# EAGLE design zeta2rework_lw_v8 (EAGLE 9.0.1)
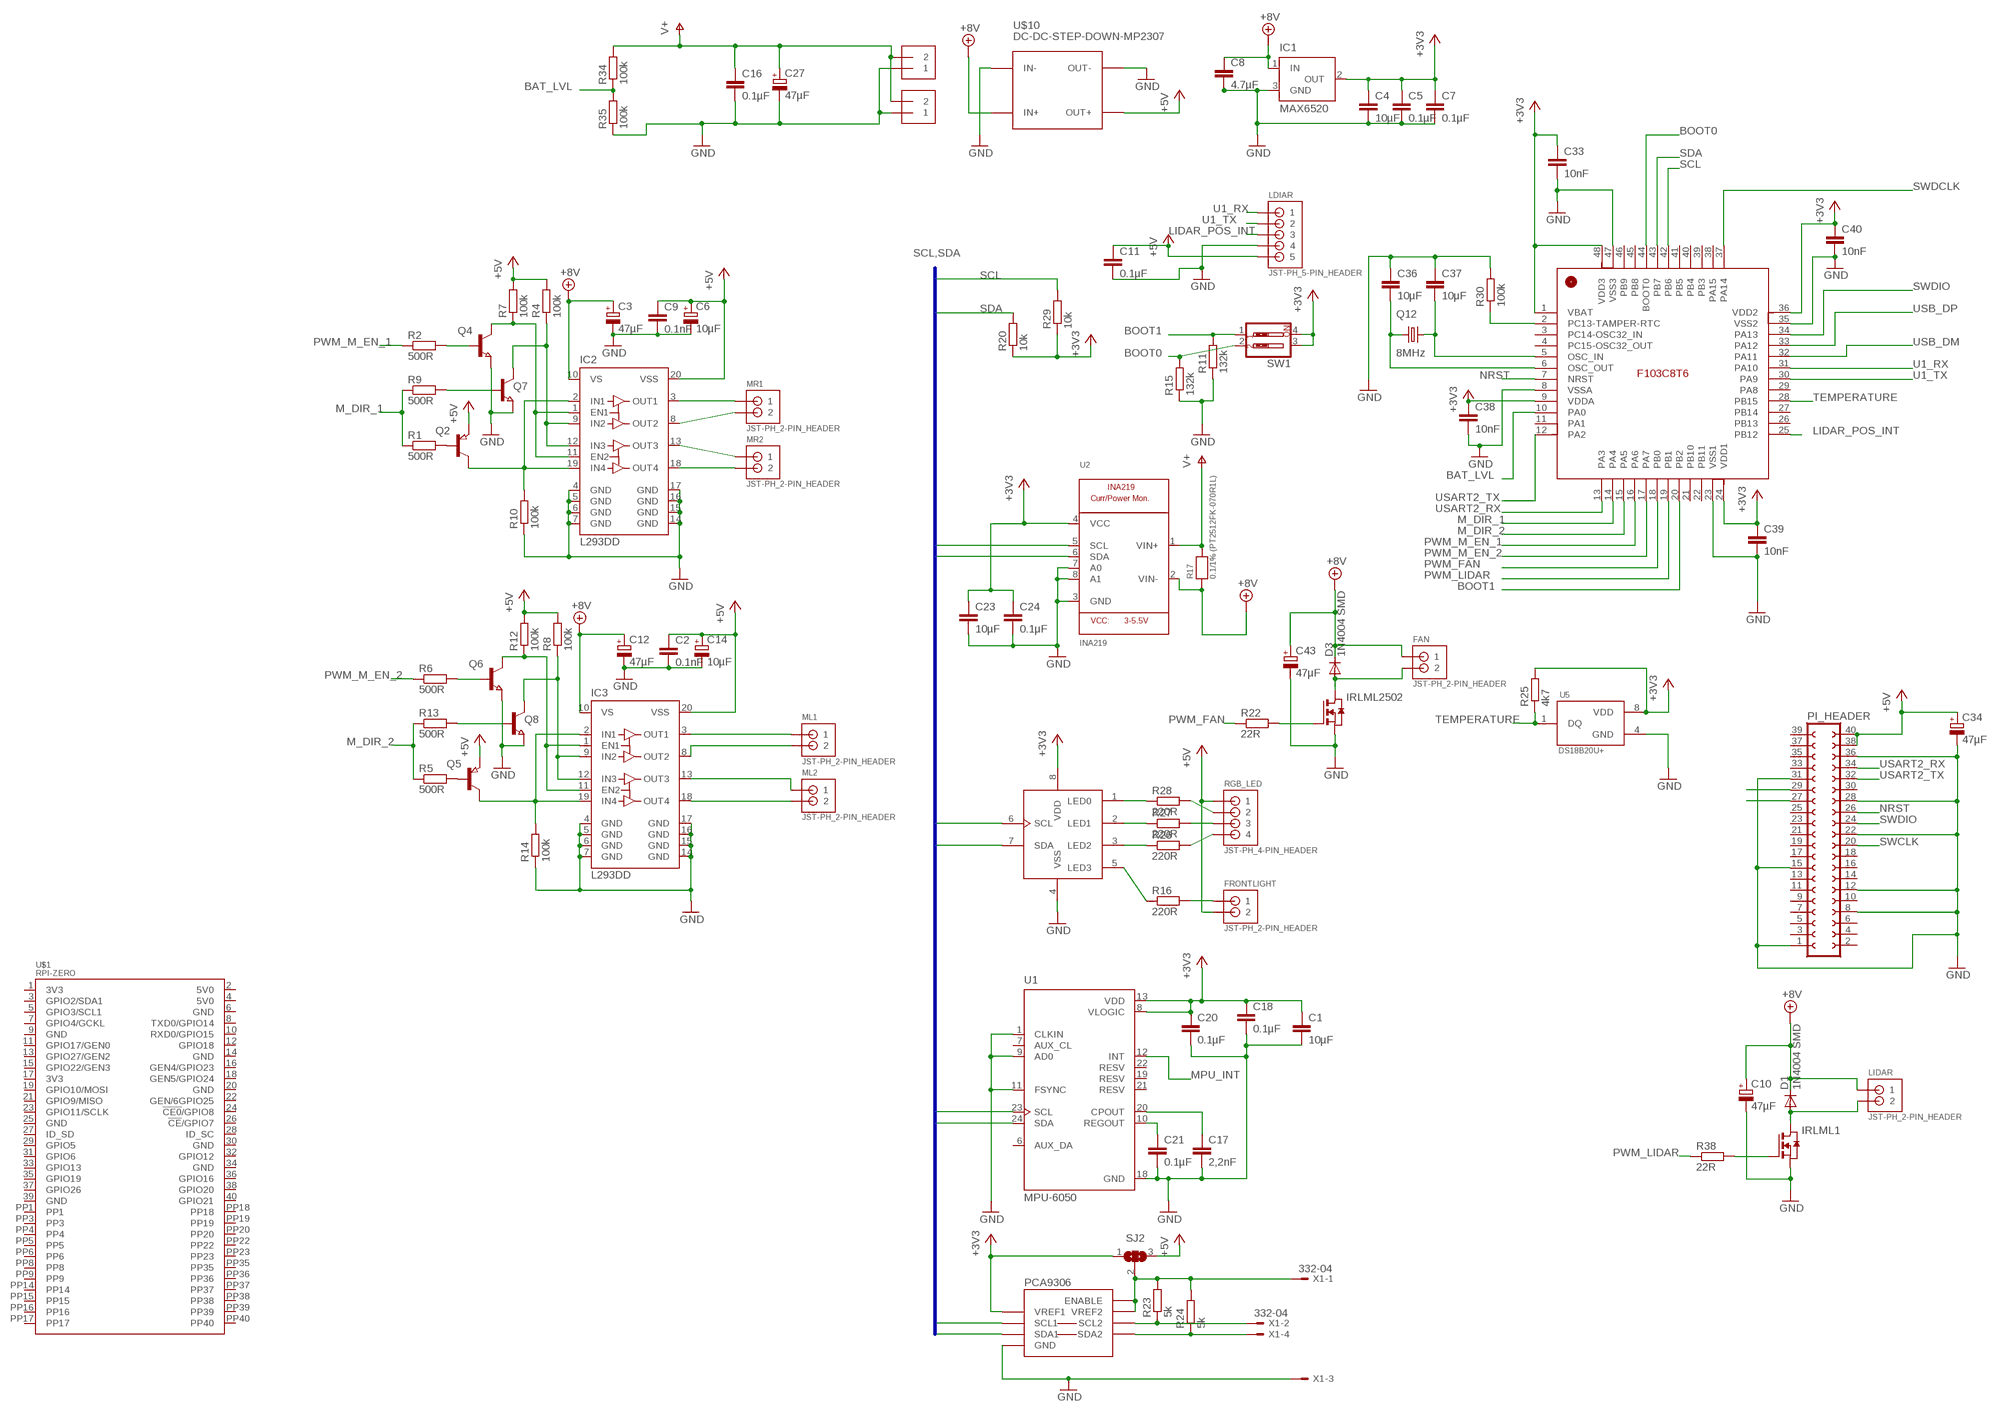
[diagram p0: schematic, sheet 1]

## Parts
C1  10µF  C-EUC1206  [C1206]
C2  0.1nF  C-EUC1206  [C1206]
C3  47µF  CPOL-EUUD-4X5,8  [UD-4X5,8_NICHICON]
C4  10µF  C-EUC1206  [C1206]
C5  0.1µF  C-EUC1206  [C1206]
C6  10µF  CPOL-EUUD-4X5,8  [UD-4X5,8_NICHICON]
C7  0.1µF  C-EUC1206  [C1206]
C8  4.7µF  C-EUC1206  [C1206]
C9  0.1nF  C-EUC1206  [C1206]
C10  47µF  CPOL-EUUD-4X5,8  [UD-4X5,8_NICHICON]
C11  0.1µF  C-EUC1206  [C1206]
C12  47µF  CPOL-EUUD-4X5,8  [UD-4X5,8_NICHICON]
C14  10µF  CPOL-EUUD-4X5,8  [UD-4X5,8_NICHICON]
C16  0.1µF  C-EUC1206  [C1206]
C17  2,2nF  C-EUC1206  [C1206]
C18  0.1µF  C-EUC1206  [C1206]
C20  0.1µF  C-EUC1206  [C1206]
C21  0.1µF  C-EUC1206  [C1206]
C23  10µF  C-EUC1206  [C1206]
C24  0.1µF  C-EUC1206  [C1206]
C27  47µF  CPOL-EUUD-4X5,8  [UD-4X5,8_NICHICON]
C33  10nF  C-EUC1206  [C1206]
C34  47µF  CPOL-EUUD-4X5,8  [UD-4X5,8_NICHICON]
C36  10µF  C-EUC1206  [C1206]
C37  10µF  C-EUC1206  [C1206]
C38  10nF  C-EUC1206  [C1206]
C39  10nF  C-EUC1206  [C1206]
C40  10nF  C-EUC1206  [C1206]
C43  47µF  CPOL-EUUD-4X5,8  [UD-4X5,8_NICHICON]
D1  1N4004 SMD  DIODE-DO214AC  [DO214AC]
D3  1N4004 SMD  DIODE-DO214AC  [DO214AC]
FAN  JST-PH_2-PIN_HEADER  [JST_B2B-PH_HEADER]
FRONTLIGHT  JST-PH_2-PIN_HEADER  [JST_B2B-PH_HEADER]
IC1  MAX6520  [SOT23]
IC2  L293DD  [SO20]
IC3  L293DD  [SO20]
IRLML1  NMOSSOT23  [SOT-23]
IRLML2502  NMOSSOT23  [SOT-23]
LDIAR  JST-PH_5-PIN_HEADER  [JST_B5B-PH_HEADER]
LIDAR  JST-PH_2-PIN_HEADER  [JST_B2B-PH_HEADER]
ML1  JST-PH_2-PIN_HEADER  [JST_B2B-PH_HEADER]
ML2  JST-PH_2-PIN_HEADER  [JST_B2B-PH_HEADER]
MR1  JST-PH_2-PIN_HEADER  [JST_B2B-PH_HEADER]
MR2  JST-PH_2-PIN_HEADER  [JST_B2B-PH_HEADER]
PCA9306  IC2_LEVEL_TRANSLATER  [SOIC-8]
PCA9533  PCA9533  [SOIC8]
PI_HEADER  FE20-2  [FE20-2]
Q2  PNP-TRANSISTOR_SOT23  [SOT23]
Q4  NPN-TRANSISTOR_SOT23  [SOT23]
Q5  PNP-TRANSISTOR_SOT23  [SOT23]
Q6  NPN-TRANSISTOR_SOT23  [SOT23]
Q7  NPN-TRANSISTOR_SOT23  [SOT23]
Q8  NPN-TRANSISTOR_SOT23  [SOT23]
Q12  8MHz  KX-13  [7.0X5.0]
R1  500R  R-EU_R0603  [R0603]
R2  500R  R-EU_R0603  [R0603]
R4  100k  R-EU_R0603  [R0603]
R5  500R  R-EU_R0603  [R0603]
R6  500R  R-EU_R0603  [R0603]
R7  100k  R-EU_R0603  [R0603]
R8  100k  R-EU_R0603  [R0603]
R9  500R  R-EU_R0603  [R0603]
R10  100k  R-EU_R0603  [R0603]
R11  132k  R-EU_R0603  [R0603]
R12  100k  R-EU_R0603  [R0603]
R13  500R  R-EU_R0603  [R0603]
R14  100k  R-EU_R0603  [R0603]
R15  132k  R-EU_R0603  [R0603]
R16  220R  R-EU_R0603  [R0603]
R17  0.1/1% (PT2512FK-070R1L)  RESISTOR2512  [2512]
R20  10k  R-EU_R0603  [R0603]
R22  22R  R-EU_R0603  [R0603]
R23  5k  R-EU_R0603  [R0603]
R24  5k  R-EU_R0603  [R0603]
R25  4k7  R-EU_R0603  [R0603]
R26  220R  R-EU_R0603  [R0603]
R27  220R  R-EU_R0603  [R0603]
R28  220R  R-EU_R0603  [R0603]
R29  10k  R-EU_R0603  [R0603]
R30  100k  R-EU_R0603  [R0603]
R34  100k  R-EU_R0603  [R0603]
R35  100k  R-EU_R0603  [R0603]
R38  22R  R-EU_R0603  [R0603]
RGB_LED  JST-PH_4-PIN_HEADER  [JST_B4B-PH_HEADER]
SJ2  SJ2W  [SJ_2]
STM32F103CB  STM32F103CB  STM32F103C8T6  [LQFP48_7X7MM_0.5MMPP]
SUPPLY_IN  TERMBLOCK_1X2-3.5MM  [1X2-3.5MM]
SUPPLY_IN1  TERMBLOCK_1X2-3.5MM  [1X2-3.5MM]
SW1  SW_DIP-2  [EDG-02]
U1  MPU-6050  [QFN50P400X400X95-24N]
U2  INA219  [SOT23-8]
U5  DS18B20U+  [SOP65P490X95-8N]
U$1  RPI-ZERO  [RASP_PI_ZERO_BOARD_FULL]
U$10  DC-DC-STEP-DOWN-MP2307  [DC-DC-STEP-DOWN-MP2307]
X1  332-04  [332-04]

## Nets
+3V3: C1.1 C4.1 C5.1 C7.1 C18.1 C20.1 C23.1 C24.1 C33.1 C38.1 C39.1 C40.1 IC1.2(OUT) PCA9306.1(VREF1) PCA9533.8(VDD) R20.1 R25.2 R29.1 SJ2.1 STM32F103CB.1(VBAT) STM32F103CB.9(VDDA) STM32F103CB.24(VDD1) STM32F103CB.36(VDD2) STM32F103CB.48(VDD3) SW1.3 SW1.4 U1.8(VLOGIC) U1.13(VDD) U2.4(VCC) U5.8(VDD)
+5V: C2.1 C6.+ C9.1 C11.1 C14.+ C34.+ FRONTLIGHT.P2 IC2.20(VSS) IC3.20(VSS) LDIAR.P5 PI_HEADER.38 PI_HEADER.40 Q2.2(E) Q5.2(E) R4.2 R7.2 R8.2 R12.2 RGB_LED.P1 SJ2.3 U$10.OUT+
+8V: C3.+ C8.1 C10.+ C12.+ C43.+ D1.C D3.C FAN.P1 IC1.1(IN) IC2.10(VS) IC3.10(VS) LIDAR.P1 R17.1 U2.2(VIN-) U$10.IN+
BAT_LVL: R34.1 R35.2 STM32F103CB.10(PA0)
BOOT0: R15.2 STM32F103CB.44(BOOT0) SW1.2
BOOT1: R11.2 STM32F103CB.20(PB2) SW1.1
BOOT2: PI_HEADER.29
BOOT3: PI_HEADER.27
GND: C1.2 C2.2 C3.- C4.2 C5.2 C6.- C7.2 C8.2 C9.2 C10.- C11.2 C12.- C14.- C16.2 C17.2 C18.2 C20.2 C21.2 C23.2 C24.2 C27.- C33.2 C34.- C36.1 C37.1 C38.2 C39.2 C40.2 C43.- IC1.3(GND) IC2.4(GND) IC2.5(GND) IC2.6(GND) IC2.7(GND) IC2.14(GND) IC2.15(GND) IC2.16(GND) IC2.17(GND) IC3.4(GND) IC3.5(GND) IC3.6(GND) IC3.7(GND) IC3.14(GND) IC3.15(GND) IC3.16(GND) IC3.17(GND) IRLML1.2(S) IRLML2502.2(S) LDIAR.P4 PCA9306.4(GND) PCA9533.4(VSS) PI_HEADER.1 PI_HEADER.8 PI_HEADER.12 PI_HEADER.15 PI_HEADER.22 PI_HEADER.28 PI_HEADER.31 PI_HEADER.36 Q4.2(E) Q6.2(E) Q7.2(E) Q8.2(E) R10.1 R11.1 R14.1 R15.1 R30.2 R35.1 STM32F103CB.8(VSSA) STM32F103CB.23(VSS1) STM32F103CB.35(VSS2) STM32F103CB.47(VSS3) SUPPLY_IN1.1 SUPPLY_IN.1 U1.1(CLKIN) U1.9(AD0) U1.11(FSYNC) U1.18(GND) U2.3(GND) U2.7(A0) U2.8(A1) U5.4(GND) U$10.IN- U$10.OUT- X1.3
LIDAR_POS_INT: LDIAR.P3 STM32F103CB.25(PB12)
M_DIR_1: R1.1 R9.1 STM32F103CB.14(PA4)
M_DIR_2: R5.1 R13.1 STM32F103CB.15(PA5)
MPU_INT: U1.12(INT)
N$1: IC2.9(IN2) IC2.12(IN3) Q7.3(C) R4.1
N$2: IC3.18(OUT4) ML2.P2
N$3: IC3.13(OUT3) ML2.P1
N$4: IC2.18(OUT4) MR2.P2
N$5: IC2.2(IN1) IC2.19(IN4) Q2.3(C) R10.2
N$6: IC3.9(IN2) IC3.12(IN3) Q8.3(C) R8.1
N$7: IC3.2(IN1) IC3.19(IN4) Q5.3(C) R14.2
N$8: IC2.1(EN1) IC2.11(EN2) Q4.3(C) R7.1
N$9: IC3.1(EN1) IC3.11(EN2) Q6.3(C) R12.1
N$10: Q2.1(B) R1.2
N$11: Q4.1(B) R2.2
N$12: Q7.1(B) R9.2
N$13: Q5.1(B) R5.2
N$14: Q6.1(B) R6.2
N$15: Q8.1(B) R13.2
N$16: IC2.13(OUT3) MR2.P1
N$17: IC2.8(OUT2) MR1.P2
N$18: IC2.3(OUT1) MR1.P1
N$20: PCA9533.5(LED3) R16.1
N$21: FRONTLIGHT.P1 R16.2
N$22: PCA9533.3(LED2) R26.1
N$23: PCA9533.2(LED1) R27.1
N$24: PCA9533.1(LED0) R28.1
N$25: IC3.8(OUT2) ML1.P2
N$26: IC3.3(OUT1) ML1.P1
N$31: R26.2 RGB_LED.P4
N$33: R27.2 RGB_LED.P3
N$34: C17.1 U1.20(CPOUT)
N$35: R28.2 RGB_LED.P2
N$36: C21.1 U1.10(REGOUT)
N$37: IRLML2502.3(G) R22.2
N$38: IRLML1.3(G) R38.2
N$39: D1.A IRLML1.1(D) LIDAR.P2
N$41: PCA9306.7(VREF2) PCA9306.8(ENABLE) R23.2 R24.2 SJ2.2 X1.1
N$42: PCA9306.6(SCL2) R23.1 X1.2
N$43: PCA9306.5(SDA2) R24.1 X1.4
N$46: C36.2 Q12.1 STM32F103CB.6(OSC_OUT)
N$47: C37.2 Q12.3 STM32F103CB.5(OSC_IN)
N$49: R30.1 STM32F103CB.2(PC13-TAMPER-RTC)
N$55: D3.A FAN.P2 IRLML2502.1(D)
NRST: PI_HEADER.26 STM32F103CB.7(NRST)
PWM_FAN: R22.1 STM32F103CB.18(PB0)
PWM_LIDAR: R38.1 STM32F103CB.19(PB1)
PWM_M_EN_1: R2.1 STM32F103CB.16(PA6)
PWM_M_EN_2: R6.1 STM32F103CB.17(PA7)
SCL: PCA9533.6(SCL) R29.2 STM32F103CB.42(PB6) U1.23(SCL) U2.5(SCL)
SCL2: PCA9306.2(SCL1)
SDA: PCA9533.7(SDA) R20.2 STM32F103CB.43(PB7) U1.24(SDA) U2.6(SDA)
SDA2: PCA9306.3(SDA1)
SWCLK: PI_HEADER.20
SWDCLK: STM32F103CB.37(PA14)
SWDIO: PI_HEADER.24 STM32F103CB.34(PA13)
TEMPERATURE: R25.1 STM32F103CB.28(PB15) U5.1(DQ)
U1_RX: LDIAR.P1 STM32F103CB.31(PA10)
U1_TX: LDIAR.P2 STM32F103CB.30(PA9)
USART2_RX: PI_HEADER.34 STM32F103CB.13(PA3)
USART2_TX: PI_HEADER.32 STM32F103CB.12(PA2)
USB_DM: STM32F103CB.32(PA11)
USB_DP: STM32F103CB.33(PA12)
V+: C16.1 C27.+ R17.2 R34.2 SUPPLY_IN1.2 SUPPLY_IN.2 U2.1(VIN+)
Unconnected: PI_HEADER.2 PI_HEADER.3 PI_HEADER.4 PI_HEADER.5 PI_HEADER.6 PI_HEADER.7 PI_HEADER.9 PI_HEADER.10 PI_HEADER.11 PI_HEADER.13 PI_HEADER.14 PI_HEADER.16 PI_HEADER.17 PI_HEADER.18 PI_HEADER.19 PI_HEADER.21 PI_HEADER.23 PI_HEADER.25 PI_HEADER.30 PI_HEADER.33 PI_HEADER.35 PI_HEADER.37 PI_HEADER.39 STM32F103CB.3(PC14-OSC32_IN) STM32F103CB.4(PC15-OSC32_OUT) STM32F103CB.11(PA1) STM32F103CB.21(PB10) STM32F103CB.22(PB11) STM32F103CB.26(PB13) STM32F103CB.27(PB14) STM32F103CB.29(PA8) STM32F103CB.38(PA15) STM32F103CB.39(PB3) STM32F103CB.40(PB4) STM32F103CB.41(PB5) STM32F103CB.45(PB8) STM32F103CB.46(PB9) U1.6(AUX_DA) U1.7(AUX_CL) U1.19(RESV) U1.21(RESV) U1.22(RESV) U$1.1(3V3) U$1.2(5V0) U$1.3(GPIO2/SDA1) U$1.4(5V0) U$1.5(GPIO3/SCL1) U$1.6(GND) U$1.7(GPIO4/GCKL) U$1.8(TXD0/GPIO14) U$1.9(GND) U$1.10(RXD0/GPIO15) U$1.11(GPIO17/GEN0) U$1.12(GPIO18) U$1.13(GPIO27/GEN2) U$1.14(GND) U$1.15(GPIO22/GEN3) U$1.16(GEN4/GPIO23) U$1.17(3V3) U$1.18(GEN5/GPIO24) U$1.19(GPIO10/MOSI) U$1.20(GND) U$1.21(GPIO9/MISO) U$1.22(GEN/6GPIO25) U$1.23(GPIO11/SCLK) U$1.24(!CE0!/GPIO8) U$1.25(GND) U$1.26(!CE!/GPIO7) U$1.27(ID_SD) U$1.28(ID_SC) U$1.29(GPIO5) U$1.30(GND) U$1.31(GPIO6) U$1.32(GPIO12) U$1.33(GPIO13) U$1.34(GND) U$1.35(GPIO19) U$1.36(GPIO16) U$1.37(GPIO26) U$1.38(GPIO20) U$1.39(GND) U$1.40(GPIO21) U$1.PP1 U$1.PP3 U$1.PP4 U$1.PP5 U$1.PP6 U$1.PP8 U$1.PP9 U$1.PP14 U$1.PP15 U$1.PP16 U$1.PP17 U$1.PP18 U$1.PP19 U$1.PP20 U$1.PP22 U$1.PP23 U$1.PP35 U$1.PP36 U$1.PP37 U$1.PP38 U$1.PP39 U$1.PP40

## Buses
SCL,SDA

## Library data of the parts
C1 C2 C4 C5 C7-C9 C11 C16-C18 C20 C21 C23 C24 C33 C36-C40 = rcl:C-EU: CAPACITOR, European symbol; SPICEPREFIX: C
C3 C6 C10 C12 C14 C27 C34 C43 = rcl:CPOL-EU: POLARIZED CAPACITOR, European symbol; SPICEPREFIX: C
D1 D3 = diode:DIODE-: DIODE
FAN FRONTLIGHT LIDAR ML1 ML2 MR1 MR2 = srg:JST-PH_2-PIN_HEADER: 2-pin JST PH Shrouded Header, top entry P/N B2B-PH-K-S Mating connector PHR-2 Mating cable assembly: Sparkfun PRT-09914 <http://www.sparkfun.com/products/9914>
IC1 = maxim:MAX6520: 1.2V Voltage Reference 50ppm/°C, SOT23, 3-Terminal Source: Data sheet <http://datasheets.maxim-ic.com/en/ds/MAX6520.pdf>; MF: MAXIM; MPN: MAX6520EUR-T; OC_FARNELL: unknown; OC_NEWARK: 02J4586
IC2 IC3 = st-microelectronics:L293DD: PUSH-PULL FOUR CHANNEL DRIVER WITH DIODES Source: http://www.st.com/stonline/books/pdf/docs/1330.pdf; OC_FARNELL: unknown
IRLML1 IRLML2502 = zetex:NMOSSOT23: MOS FET; OC_FARNELL: unknown; OC_NEWARK: unknown
LDIAR = srg:JST-PH_5-PIN_HEADER: 5-pin JST PH Shrouded Header, top entry P/N B5B-PH-K-S Mating connector PHR-5 Mating cable assembly: Sparkfun PRT-09917 <http://www.sparkfun.com/products/9917>
PCA9306 = srg:IC2_LEVEL_TRANSLATER: I2C Level Translator PCA9306 Data Sheet <http://www.ti.com/lit/ds/symlink/pca9306.pdf> Sparkfun breakout board schematic <http://dlnmh9ip6v2uc.cloudfront.net/datasheets/BreakoutBoards/PCA9306_Breakout.pdf>
PCA9533 = adam - ics:PCA9533: PCA9533D/01: LED driver and dimmer 4 channel, PWM @ 8 bit resolution 25mA / channel sink external resistors per LED I2C protocol @ 400kHz (fast) digikey: 568-3372-5-ND, 8-SOIC, $1.92
PI_HEADER = con-lsta:FE20-2: FEMALE HEADER; OC_FARNELL: unknown; OC_NEWARK: unknown
Q2 Q5 = semicon-smd-ipc:PNP-TRANSISTOR_: PNP TRANSISTOR
Q4 Q6-Q8 = semicon-smd-ipc:NPN-TRANSISTOR_: NPN TRANSISTOR
Q12 = crystal-geyer_V1_0:KX: Quartz Crystals (MHz) SMD: KX - Serie Model Size l/w/h [mm] Frequency Range Frequency Stability Temp. Range [°C] Load Capacitance AECQ 200 availabel Datasheet KX-4 KX-5 KX-6 KX-7 KX-9A KX-9B KX-12A KX-12B KX-13 KX-20 KX-K KX-KS 1.6/1.2/0.3 2.0/1.6/0.45 2.5/2.0/0.55 3.2/2.5/0.8 5.0/3.2/1.0 5.0/3.2/1.1 6.0/3.5/1.1 6.0/3.5/1.0 7.0/5.0 /1.3 11.6/5.5/1.6 12.3/4.5/4.2 12.3/4.5/3.2 24.0 ~ 80.0 MHz 16.0 ~ 80.0 MHz 12.0 ~ 80.0 MHz 8.0 ~ 60.0 MHz 7,68 ~ 300,0 MHz 8,0 ~ 50,0 MHz 8,0 ~ 150,0 MHz 8,0 ~ 50,0 MHz 6,0 ~ 160,0 MHz 3,579 ~ 25,0 MHz 3,579 ~ 70,0 MHz 3,579 ~ 70,0 MHz ±10 … ±50ppm ±10 … ±50ppm ±10 … ±50ppm ±10 … ±50ppm ±10 … ±50ppm ±10 … ±50ppm ±10 … ±50ppm ±10 … ±50ppm ±10 … ±50ppm ±50ppm ±10 … ±50ppm ±10 … ±50ppm (*) -40°C …+85°C (*) -40°C …+125°C (*) -40°C …+125°C (*) -40°C …+125°C (*) -40°C …+105°C (*) -40°C …+105°C (*) -40°C …+125°C (*) -40°C …+105°C (*) -40°C …+105°C (*) -40°C …+105°C (*) -40°C …+85°C (*) -40°C …+85°C 8, 8…16 8, 8…16 10, 8…16 12, 7…20 16, 10…20 16, 10…20 16, 10…20 16, 12…20 16, 12…20 16, 12…20 16, 12…30 16, 12…30 - yes yes yes - - - - - - - - KX-4.pdf <http://www.geyer-electronic.de/uploads/tx_userartikelfrequenz/GEYER-KX-4.pdf> KX-5.pdf <http://www.geyer-electronic.de/uploads/tx_userartikelfrequenz/GEYER-KX-5.pdf> KX-6.pdf <http://www.geyer-electronic.de/uploads/tx_userartikelfrequenz/GEYER-KX-6.pdf> KX-7.pdf <http://www.geyer-electronic.de/uploads/tx_userartikelfrequenz/GEYER-KX-7.pdf> KX-9A.pdf <http://www.geyer-electronic.de/uploads/tx_userartikelfrequenz/GEYER-KX-9A.pdf> KX-9B.pdf <http://www.geyer-electronic.de/uploads/tx_userartikelfrequenz/GEYER-KX-9B.pdf> KX-12A.pdf <http://www.geyer-electronic.de/uploads/tx_userartikelfrequenz/GEYER-KX-12A.pdf> KX-12B.pdf <http://www.geyer-electronic.de/uploads/tx_userartikelfrequenz/GEYER-KX-12B.pdf> KX-13.pdf <http://www.geyer-electronic.de/uploads/tx_userartikelfrequenz/GEYER-KX-13.pdf> KX-20.pdf <http://www.geyer-electronic.de/uploads/tx_userartikelfrequenz/GEYER-KX-20.pdf> KX-K.pdf <http://www.geyer-electronic.de/uploads/tx_userartikelfrequenz/GEYER-KX-K.pdf> KX-KS.pdf <http://www.geyer-electronic.de/uploads/tx_userartikelfrequenz/GEYER-KX-KS.pdf> <http://www.geyer-electronic.de/fileadmin/template/img/logo-geyer-electronic.png> Details see: http://www.geyer-electronic.de/Frequenz-Produkte.9.0.html Created 2016-06-07, Hans Locher 2016 (C) Geyer Quartz Technology KX4,KX5,KX6,KX7,KX9A,KX9B,KX12A,KX12B,KX13,KX20,KXK,KXKS;1612;2016;2520;3225;5032;6035;7050;11655;12345;1,6x1,2;2,0x1,6;2,5x2,0;3,2x2,5;5,0x3,2;6,0x3,5;7,0x5,0;11,6x5,5;12,3x4,5;12,3x4,5;1.6x1.2;2.0x1.6;2.5x2.0;3.2x2.5;5.0x3.2;6.0x3.5;7.0x5.0;11.6x5.5;12.3x4.5;12.3x4.5;
R1 R2 R4-R16 R20 R22-R30 R34 R35 R38 = rcl:R-EU_: RESISTOR, European symbol; SPICEPREFIX: R
R17 = microbuilder:RESISTOR: Resistors 0402 - 0402 Surface Mount Package 22 Ohm 1% 1/16W [Digikey: 311-22.0LRTR-ND] 33 Ohm 5% 1/16W 1.0K 5% 1/16W 1.5K 5% 1/16W 2.0K 1% 1/16W 10.0K 1% 1/16W [Digikey: 311-10.0KLRTR-ND] 10.0K 5% 1/16W [Digikey: RMCF0402JT10K0TR-ND] 12.1K 1% 1/16W [Digikey: 311-22.0LRTR-ND] 100.0K 5% 1/16W 0603 - 0603 Surface Mount Package 0 Ohm 1/10 Watt 1% Resistor 15 Ohm 1/10 Watt 1% Resistor 33 Ohm 1/10 Watt 1% Resistor 49.9 Ohm 1/10 Watt 1% Resistor 100 Ohm 1/10 Watt 1% Resistor 150 Ohm 1/10 Watt 1% Resistor 240 Ohm 1/10 Watt 1% Resistor 390 Ohm 1/10 Watt 1% Resistor 560 Ohm 1/10 Watt 1% Resistor 680 Ohm 1/10 Watt 1% Resistor 750 Ohm 1/10 Watt 1% Resistor 1.0K Ohm 1/10 Watt 1% Resistor 1.5K Ohm 1/10 Watt 1% Resistor 2.0K Ohm 1/10 Watt 1% Resistor 2.2K Ohm 1/10 Watt 1% Resistor 3.3K Ohm 1/10 Watt 1% Resistor 4.7K Ohm 1/10 Watt 1% Resistor 10.0K Ohm 1/10 Watt 1% Resistor 12.0K Ohm 1/10 Watt 1% Resistor 12.1K Ohm 1/10 Watt 1% Resistor 20.0K Ohm 1/10 Watt 1% Resistor 33.0K Ohm 1/10 Watt 1% Resistor 100.0K Ohm 1/10 Watt 1% Resistor 0805 - 0805 Surface Mount Package 0 Ohm 1/8 Watt 1% Resistor 33 Ohm 1/8 Watt 1% Resistor 100 Ohm 1/8 Watt 1% Resistor 150 Ohm 1/8 Watt 1% Resistor 200 Ohm 1/8 Watt 1% Resistor 240 Ohm 1/8 Watt 1% Resistor 330 Ohm 1/8 Watt 1% Resistor 390 Ohm 1/8 Watt 1% Resistor 470 Ohm 1/8 Watt 1% Resistor 1.0K Ohm 1/8 Watt 1% Resistor 1.5K Ohm 1/8 Watt 1% Resistor 2.0K Ohm 1/8 Watt 1% Resistor 4.7K Ohm 1/8 Watt 1% Resistor 5.1K Ohm 1/8 Watt 1% Resistor 5.6K Ohm 1/8 Watt 1% Resistor 10.0K Ohm 1/8 Watt 1% Resistor 22.0K Ohm 1/8 Watt 1% Resistor 33.0K Ohm 1/8 Watt 1% Resistor 100K Ohm 1/8 Watt 1% Resistor 1206 - 1206 Surface Mount Package 2012 - 2010 Surface Mount Package 0.11 Ohm 1/2 Watt 1% Resistor - Digikey: RHM.11UCT-ND
RGB_LED = srg:JST-PH_4-PIN_HEADER: 4-pin JST PH Shrouded Header, top entry P/N B4B-PH-K-S Mating connector PHR-4 Mating cable assembly: Sparkfun PRT-09916 <http://www.sparkfun.com/products/9916>
SJ2 = jumper:SJ2W: SMD solder JUMPER
STM32F103CB = STM32F103C8T6:STM32F103C8T6; AVAILABILITY: Good; DESCRIPTION: Mainstream Performance line, ARM Cortex-M3 MCU with 64 Kbytes Flash, 72 MHz CPU, motor control, USB and CAN; MF: STMicroelectronics; MP: STM32F103C8T6; PACKAGE: LQFP-48 STMicroelectronics; PRICE: 3.83 USD
SUPPLY_IN SUPPLY_IN1 = microbuilder:TERMBLOCK_1X2: 3.5mm Terminal block http://www.ladyada.net/library/pcb/eaglelibrary.html
SW1 = special:SW_DIP-2: DIP SWITCH
U1 = MPU-6050:MPU-6050: MPU-6050 Six-Axis (Gyro + Accelerometer) MEMS MotionTracking™ Devices; AVAILABILITY: Good; DESCRIPTION: 3-axis gyroscope, 3-axis accelerometer in a 4x4x0.9 housing; MF: TDK; MP: MPU-6050; PACKAGE: QFN-24 InvenSense; PRICE: 5.12 USD
U2 = INA219:INA219: INA219 - I2C Current/Power Monitor Voltage Range: 0-26V Accuracy: 0.5% Temperature: -40°C - 125°C; AVAILABILITY: Unavailable; DESCRIPTION: the ina219 is a high-side current shunt and power monitor with an i2c interface. the ina219 monitors both shunt drop ...; MF: Texas Instruments; MP: INA219; PACKAGE: None; PRICE: None
U5 = DS18B20U_:DS18B20U+: Board Mount Temperature Sensors Prgmble Resolution 1-Wire Parasite Pwr; AVAILABILITY: Unavailable; DESCRIPTION: Date Code: 1043+; RoHS Compliant: Yes;; MF: Maxim; MP: DS18B20U+; PACKAGE: TSSOP-8 Chip Coolers; PRICE: None
U$1 = rpi-zero:RPI-ZERO
U$10 = diy-modules:DC-DC-STEP-DOWN-MP2307: DC/DC Step-Down Regulator based on MP2307DN chip MP2307 datasheet available here: https://cdn-shop.adafruit.com/datasheets/MP2307_r1.9.pdf Click here to find device on ebay.com <http://www.ebay.com/sch/dc+dc+3a+mini+converter>
X1 = con-garry:332-04: 4 Pin - 2mm Dual Row Source: www.mpe-connector.de / garry_shortform_2012.pdf

## Board
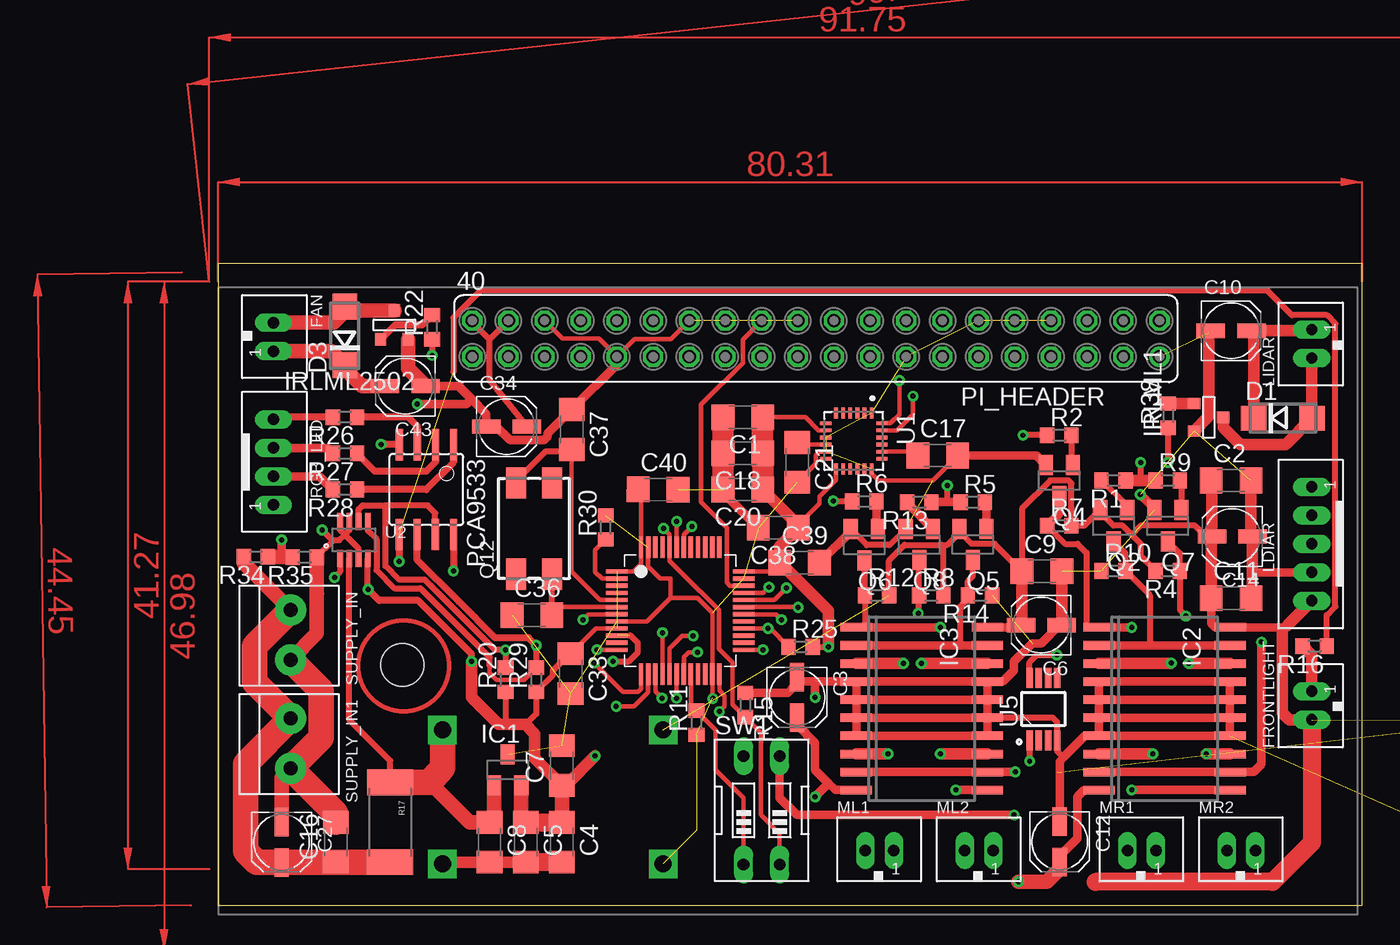
[diagram p1: board, top side]
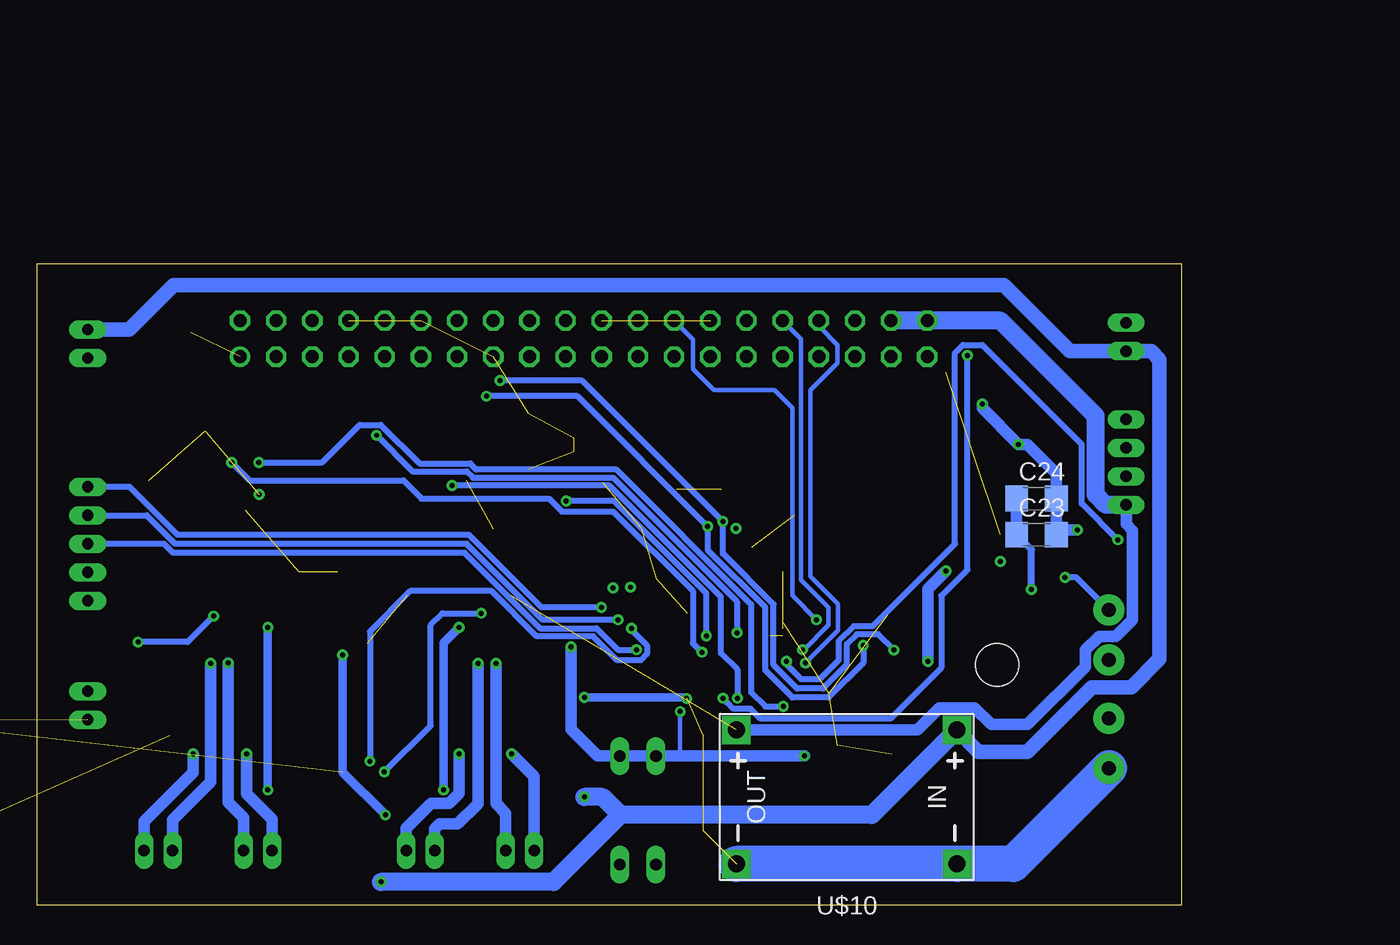
[diagram p2: board, bottom side, seen from below]

Size 80.31 x 45.08 mm. Coordinates in mm from the lower left corner, seen from the top.
Outline: 0,0 80.31,0 80.31,45.08 0,45.08 0,0
Copper layers (1*16): Top 0.035mm / dielectric 1.5mm / Bottom 0.035mm
Design rules "default": minimum track width 6mil, minimum drill 0.35mm, track to track 6mil, track to pad 6mil, pad to pad 6mil, via to via 6mil, smd to smd 6mil, copper to edge 40mil, drill to drill 6mil, minimum pad ring 10mil, minimum via ring 8mil, stop-mask expansion 4mil, vias tented up to drill 0mil, thermal gap 10mil
Holes 3 mm at 12.93,16.89

### Footprints (pad centres in the part's own frame; a part is rotated, then mirrored left to right if it is on the bottom)
C1206 = smd 1.6 x 1.8: 1 -1.4,0; 2 1.4,0
UD-4X5,8_NICHICON = smd 2 x 1: + 1.425,0; - -1.425,0
DO214AC = smd 1.8 x 1.7: A 2.05,0; C -2.05,0
JST_B2B-PH_HEADER = drill 0.8 long: P1 1.075,0.048; P2 -0.925,0.048
SOT23 = smd 1 x 1.4: 1 -0.95,-1.1; 2 0.95,-1.1; 3 0,1.1
SO20 = smd 0.6 x 2.2: 1 -5.715,-4.6; 2 -4.445,-4.6; 3 -3.175,-4.6; 4 -1.905,-4.6; 5 -0.635,-4.6; 6 0.635,-4.6; 7 1.905,-4.6; 8 3.175,-4.6; 9 4.445,-4.6; 10 5.715,-4.6; 11 5.715,4.6; 12 4.445,4.6; 13 3.175,4.6; 14 1.905,4.6; 15 0.635,4.6; 16 -0.635,4.6; 17 -1.905,4.6; 18 -3.175,4.6; 19 -4.445,4.6; 20 -5.715,4.6
SOT-23 = smd 0.787 x 0.889: 1 0.025,-1.016; 2 -0.94,1.016; 3 0.991,1.016
JST_B5B-PH_HEADER = drill 0.8 long: P1 4,0.048; P2 2,0.048; P3 0,0.048; P4 -2,0.048; P5 -4,0.048
SOIC-8 = smd 0.66 x 2.032: 1 -1.905,-3.073; 2 -0.635,-3.073; 3 0.635,-3.073; 4 1.905,-3.073; 5 1.905,3.073; 6 0.635,3.073; 7 -0.635,3.073; 8 -1.905,3.073
SOIC8 = smd 0.5 x 2.2: 1 -1.905,-3.154; 2 -0.645,-3.154; 3 0.625,-3.154; 4 1.895,-3.154; 5 1.905,3.154; 6 0.635,3.154; 7 -0.635,3.154; 8 -1.905,3.154
FE20-2 = drill 0.914: 1 -24.13,1.27 | drill 0.914 octagon: 2 -24.13,-1.27; 3 -21.59,1.27; 4 -21.59,-1.27; 5 -19.05,1.27; 6 -19.05,-1.27; 7 -16.51,1.27; 8 -16.51,-1.27; 9 -13.97,1.27; 10 -13.97,-1.27; 11 -11.43,1.27; 12 -11.43,-1.27; 13 -8.89,1.27; 14 -8.89,-1.27; 15 -6.35,1.27; 16 -6.35,-1.27; 17 -3.81,1.27; 18 -3.81,-1.27; 19 -1.27,1.27; 20 -1.27,-1.27; 21 1.27,1.27; 22 1.27,-1.27; 23 3.81,1.27; 24 3.81,-1.27; 25 6.35,1.27; 26 6.35,-1.27; 27 8.89,1.27; 28 8.89,-1.27; 29 11.43,1.27; 30 11.43,-1.27; 31 13.97,1.27; 32 13.97,-1.27; 33 16.51,1.27; 34 16.51,-1.27; 35 19.05,1.27; 36 19.05,-1.27; 37 21.59,1.27; 38 21.59,-1.27; 39 24.13,1.27; 40 24.13,-1.27
7.0X5.0 = smd 2.2 x 1.4: 1 -3.2,-1.25; 2 3.2,-1.25; 3 3.2,1.25; 4 -3.2,1.25
R0603 = smd 1 x 1.1: 1 -0.85,0; 2 0.85,0
2512 = smd 1.8 x 3.2: 1 -2.8,0; 2 2.8,0
JST_B4B-PH_HEADER = drill 0.8 long: P1 2.98,0.048; P2 0.98,0.048; P3 -1.02,0.048; P4 -3.02,0.048
SJ_2 = smd 1.168 x 1.6: 1 -1.524,0; 2 0,0; 3 1.524,0
LQFP48_7X7MM_0.5MMPP = smd 1.5 x 0.3: 1 -4.45,2.75; 2 -4.45,2.25; 3 -4.45,1.75; 4 -4.45,1.25; 5 -4.45,0.75; 6 -4.45,0.25; 7 -4.45,-0.25; 8 -4.45,-0.75; 9 -4.45,-1.25; 10 -4.45,-1.75; 11 -4.45,-2.25; 12 -4.45,-2.75; 25 4.45,-2.75; 26 4.45,-2.25; 27 4.45,-1.75; 28 4.45,-1.25; 29 4.45,-0.75; 30 4.45,-0.25; 31 4.45,0.25; 32 4.45,0.75; 33 4.45,1.25; 34 4.45,1.75; 35 4.45,2.25; 36 4.45,2.75 | smd 0.3 x 1.5: 13 -2.75,-4.45; 14 -2.25,-4.45; 15 -1.75,-4.45; 16 -1.25,-4.45; 17 -0.75,-4.45; 18 -0.25,-4.45; 19 0.25,-4.45; 20 0.75,-4.45; 21 1.25,-4.45; 22 1.75,-4.45; 23 2.25,-4.45; 24 2.75,-4.45; 37 2.75,4.45; 38 2.25,4.45; 39 1.75,4.45; 40 1.25,4.45; 41 0.75,4.45; 42 0.25,4.45; 43 -0.25,4.45; 44 -0.75,4.45; 45 -1.25,4.45; 46 -1.75,4.45; 47 -2.25,4.45; 48 -2.75,4.45
1X2-3.5MM = drill 1 pad 2.184: 1 1.8,0; 2 -1.7,0
EDG-02 = drill 0.813 long: 1 -1.27,-3.81; 2 1.27,-3.81; 3 1.27,3.81; 4 -1.27,3.81
QFN50P400X400X95-24N = smd 0.79 x 0.26: 1 -1.97,1.25; 2 -1.97,0.75; 3 -1.97,0.25; 4 -1.97,-0.25; 5 -1.97,-0.75; 6 -1.97,-1.25; 13 1.97,-1.25; 14 1.97,-0.75; 15 1.97,-0.25; 16 1.97,0.25; 17 1.97,0.75; 18 1.97,1.25 | smd 0.26 x 0.79: 7 -1.25,-1.97; 8 -0.75,-1.97; 9 -0.25,-1.97; 10 0.25,-1.97; 11 0.75,-1.97; 12 1.25,-1.97; 19 1.25,1.97; 20 0.75,1.97; 21 0.25,1.97; 22 -0.25,1.97; 23 -0.75,1.97; 24 -1.25,1.97
SOT23-8 = smd 0.4 x 1.2: 1 -0.975,-1.3; 2 -0.325,-1.3; 3 0.325,-1.3; 4 0.975,-1.3; 5 0.975,1.3; 6 0.325,1.3; 7 -0.325,1.3; 8 -0.975,1.3
SOP65P490X95-8N = smd 1.4 x 0.45: 1 -2.2,0.975; 2 -2.2,0.325; 3 -2.2,-0.325; 4 -2.2,-0.975; 5 2.2,-0.975; 6 2.2,-0.325; 7 2.2,0.325; 8 2.2,0.975
RASP_PI_ZERO_BOARD_FULL = drill 1 pad 1.778 square: 1 8.37,25.23 | drill 1 pad 1.778: 2 8.37,27.77; 3 10.91,25.23; 4 10.91,27.77; 5 13.45,25.23; 6 13.45,27.77; 7 15.99,25.23; 8 15.99,27.77; 9 18.53,25.23; 10 18.53,27.77; 11 21.07,25.23; 12 21.07,27.77; 13 23.61,25.23; 14 23.61,27.77; 15 26.15,25.23; 16 26.15,27.77; 17 28.69,25.23; 18 28.69,27.77; 19 31.23,25.23; 20 31.23,27.77; 21 33.77,25.23; 22 33.77,27.77; 23 36.31,25.23; 24 36.31,27.77; 25 38.85,25.23; 26 38.85,27.77; 27 41.39,25.23; 28 41.39,27.77; 29 43.93,25.23; 30 43.93,27.77; 31 46.47,25.23; 32 46.47,27.77; 33 49.01,25.23; 34 49.01,27.77; 35 51.55,25.23; 36 51.55,27.77; 37 54.09,25.23; 38 54.09,27.77; 39 56.63,25.23; 40 56.63,27.77 | drill 0.8 pad 1.778: PP1 10.699,4.832; PP3 7.593,8.858; PP4 7.133,14.38; PP5 55.796,23.124; PP6 10.699,2.301; PP8 5.177,8.858; PP9 9.549,14.38; PP14 58.327,18.407; PP15 55.796,14.265; PP16 55.796,20.363; PP17 58.212,21.743; PP18 55.796,17.027; PP19 58.327,15.186; PP20 56.832,9.434; PP35 17.257,2.416; PP36 60.628,12.425; PP37 56.026,2.071; PP38 53.726,2.416; PP39 58.097,12.54; PP40 18.867,6.212 | drill 0.8 pad 1.422: PP22 23.009,2.071; PP23 24.734,2.071 | hole 2.75: 3.5,3.5; 3.5,26.5; 61.5,3.5; 61.5,26.5
DC-DC-STEP-DOWN-MP2307 = drill 1.2 pad 2 square: IN+ -7.747,-4.699; IN- -7.747,4.699; OUT+ 7.747,-4.699; OUT- 7.747,4.699
332-04 = drill 0.9 pad 1.27: 1 -1,-1; 2 -1,1; 3 1,-1; 4 1,1

### Placement (x,y rotation side)
C1  36.83,34.29 180 top
C2  71.12,29.85 0 top
C3  40.64,14.61 270 top
C4  24.13,4.44 270 top
C5  21.59,4.44 270 top
C6  57.78,19.68 180 top
C7  24.13,9.83 90 top
C8  19.05,4.44 270 top
C9  57.84,23.47 0 top
C10  71.12,40.36 0 top
C11  71.12,21.59 0 top
C12  59.08,4.47 270 top
C14  71.2,25.91 180 top
C16  8.26,4.44 90 top
C17  50.52,31.6 0 top
C18  36.83,31.75 180 top
C20  36.83,29.21 180 top
C21  40.64,31.11 270 top
C23  10.16,26.04 0 bottom
C24  10.16,28.57 0 bottom
C27  4.45,4.44 270 top
C33  24.74,16.28 270 top
C34  20.24,33.63 0 top
C36  22.02,20.4 0 top
C37  24.82,33.43 270 top
C38  39.32,26.52 180 top
C39  40.82,24.08 0 top
C40  30.89,29.21 359.8 top
C43  13.13,36.47 180 top
D1  74.75,34.21 0 top
D3  8.89,40.01 90 top
FAN  3.81,40.01 270 top
FRONTLIGHT  76.83,13.97 90 top
IC1  20.32,9.52 0 top
IC2  66.45,13.82 270 top
IC3  49.4,13.82 270 top
IRLML1  69.55,34.26 90 top
IRLML2502  12.4,40.77 180 top
LDIAR  76.83,25.4 90 top
LIDAR  76.83,39.37 90 top
ML1  46.35,3.81 0 top
ML2  53.34,3.81 0 top
MR1  64.77,3.81 0 top
MR2  71.75,3.81 0 top
PCA9306  93.12,9.98 180 bottom  (outside the outline)
PCA9533  14.61,29.21 180 top
PI_HEADER  41.96,39.8 180 top
Q2  62.87,26.67 180 top
Q4  59.05,29.85 180 top
Q5  52.98,25.35 180 top
Q6  45.36,25.32 180 top
Q7  66.67,26.67 180 top
Q8  49.23,25.35 180 top
Q12  22.17,26.47 90 top
R1  62.87,29.85 180 top
R2  59.05,33.02 0 top
R4  66.67,23.49 180 top
R5  52.98,28.32 0 top
R6  45.36,28.37 0 top
R7  59.05,26.67 0 top
R8  50.06,21.77 0 top
R9  66.67,29.85 0 top
R10  62.87,23.49 0 top
R11  33.58,12.83 90 top
R12  46.25,21.77 0 top
R13  49.23,28.32 180 top
R14  53.49,21.77 180 top
R15  37.01,14.07 270 top
R16  76.99,18.21 180 top
R17  12.06,5.84 270 top
R20  20.17,15.85 90 top
R22  15.01,40.61 90 top
R23  103.38,8.59 270 top  (outside the outline)
R24  97.71,9.19 270 top  (outside the outline)
R25  40.89,18.16 0 top
R26  8.89,34.29 180 top
R27  8.89,31.75 180 top
R28  8.89,29.21 180 top
R29  22.33,15.85 90 top
R30  27.2,26.54 90 top
R34  2.64,24.49 180 top
R35  6.07,24.46 180 top
R38  66.7,34.39 90 top
RGB_LED  3.81,31.11 270 top
SJ2  106.93,12.95 180 bottom  (outside the outline)
STM32F103CB  32.44,20.7 0 top
SUPPLY_IN  5.08,19.05 270 top
SUPPLY_IN1  5.08,11.43 270 top
SW1  38.15,6.68 0 top
U1  44.63,32.61 270 top
U2  9.53,25.68 0 top
U5  57.94,13.79 90 top
U$1  -10.79,-46.35 0 top  (outside the outline)
U$10  23.5,7.62 180 bottom
X1  88.9,2.54 90 top  (outside the outline)

### Tracks (layer width: path | path; a pad name or v marks a point on that pad's centre or on a via)
+3V3  (via drill 0.35)  (4 unrouted)
  Top 0.305: U1.8 42.15,33.36 41.22,34.29 C1.1 | STM32F103CB.24 35.19,15.11 35.56,14.73 35.56,13.97 35.2,13.61 v35.18,13.61 | C40.1 29.69,29.01 STM32F103CB.48 29.69,23.97 29.17,23.45 STM32F103CB.1 | STM32F103CB.36 38.79,23.45 C39.1 | U1.13 43.38,29.89 42.22,28.73 42.22,28.22 40.72,26.72 C38.1 | STM32F103CB.9 26.51,19.45 C33.1
  Top 0.406: U5.8 56.96,17.08 57.48,17.6 v58.88,17.6 | 24.49,17.21 C33.1 | 25.12,17.68 C33.1 | R20.1 20.17,12.85 20.32,12.7 | 21.59,12.7 22.33,13.44 R29.1 23.5,16.17 23.5,16.51 24.67,17.68 C33.1 | 24.79,17.68 C33.1 | R25.2 v42.85,18.16 | v10.52,22.2 10.5,22.21 U2.4
  Top 0.508: PCA9533.8 v16.51,23.49 | v10.52,22.2 11.3,21.41 14.05,21.41 17.78,17.68 v17.78,17.14
  Top 0.61: SW1.3 39.42,7.57 40.64,6.35 v55.88,6.35
  Top 0.813: C7.1 23.73,8.03 | C7.1 22.23,10.33 22.23,12.06 21.59,12.7 20.32,12.7 19.68,12.7 17.78,14.61 v17.78,17.14 | v26.47,10.49 24.41,8.43 C7.1 | v42.85,18.16 42.85,20.68 39.45,24.08 C39.1 39.42,25.22 C38.1 40.72,26.72 C20.1
  Top 1.016: IC1.2 21.27,6.17 C5.1 | C7.1 C4.1
  Top 1.27: C5.1 C4.1
  Top 1.524: C20.1 38.26,30.33 C18.1 C1.1
  Bottom 0.305: 35.71,10.64 35.56,10.49 35.18,10.87 v35.18,13.61 | 34.75,10.67 34.92,10.49
  Bottom 0.508: v10.52,22.2 10.52,24.99 C23.1
  Bottom 0.61: v58.88,17.6 58.88,9.35 v55.88,6.35
  Bottom 0.813: v26.47,10.49 34.92,10.49 35.56,10.49 SW1.4 SW1.3 40.97,10.49 42.85,12.37 42.85,18.15 | v16.51,23.49 17.78,22.22 v17.78,17.14 | C24.1 C23.1
+5V  (2 unrouted)
  Top 0.305: 52.03,26.17 52.03,26.25
  Top 0.406: R12.2 47.1,24.24 48.18,25.32 50.8,25.32 | 52.03,26.17 51.19,25.32 50.8,25.32 | R8.2 50.91,25.21 50.8,25.32 | C34.+ 19.05,36.88 19.05,39.75 | 19.05,39.75 PI_HEADER.38 | 19.05,39.75 17.83,40.97 PI_HEADER.40 | R4.2 64.77,24.55 64.77,25.4 64.14,26.04 | 64.14,26.04 63.5,26.67 62.87,26.67 61.91,27.62 Q2.2 60.81,26.67 R7.2 59.91,27.89 59.91,27.9 59.91,29.62 59.69,29.85 58.42,29.85 56.44,27.86 C9.1 54.51,25.39 52.89,25.39 52.03,26.25 Q5.2 | 64.14,26.04 64.77,26.67 68.58,26.67 69.34,25.91 C14.+
  Top 0.61: IC3.20 56.21,19.53 C6.+ | 69.72,20.95 69.72,19.81 70,19.53 IC2.20 74.92,19.53 75.1,19.71
  Top 0.813: C6.+ 56.44,19.76 C9.1 | C2.1 69.77,29.79 C14.+ 69.72,25.86 C11.1 69.72,20.95 | LDIAR.P5 75.1,19.71 74.73,19.34 74.73,13.54 75.22,13.04 FRONTLIGHT.P2
  Top 1.27: FRONTLIGHT.P2 76.79,4.4 74.04,1.65 61.59,1.65
  Bottom 0.813: U$10.OUT+ 18.54,12.32 16.98,13.88 14.52,13.88 13.34,12.7 10.79,12.7 6.73,16.76 6.73,17.93 5.76,18.9 4.59,18.9 3.43,20.07 3.43,26.34 3.86,26.77 RGB_LED.P1
  Bottom 1.27: RGB_LED.P1 5.28,28.14 5.99,28.85 5.99,34.38 12.69,41.07 PI_HEADER.40 PI_HEADER.38
+8V  (via drill 0.35)
  Top 0.406: 10.85,8.31 10.79,8.25 11.68,8.25 R17.1 12.06,10.16 9.2,13.02 U2.2
  Top 0.61: IC2.10 60.81,8.1 60.33,7.62 60.33,4.72 59.08,3.48 C12.+ | IC3.10 43.33,8.1 42.86,8.57 | C3.+ 40.64,12.7 41.91,11.43 41.91,9.52 42.86,8.57 | v41.91,7.62 42.86,8.57
  Top 0.813: LIDAR.P1 76.7,40.36 C10.+ 72.7,40.2 D1.C
  Top 1.016: C43.+ 10.09,36.47 8.89,37.68 D3.C 7.94,38.93 FAN.P1 | IC1.1 19.37,6.17 C8.1 17.65,5.84 14.85,8.64 | v56.19,1.65 58.17,1.65 59.08,2.57 C12.+
  Top 1.778: R17.1 14.85,8.64 15.75,9.65 U$10.IN+
  Bottom 1.016: LIDAR.P1 73.86,40.45 70.75,43.55 12.44,43.55 7.82,38.93 FAN.P1 2.1,38.93 1.52,38.35 1.52,17.3 3.5,15.32 6.27,15.32 10.79,10.79 14.22,10.79 U$10.IN+
  Bottom 1.27: 39.37,6.35 44.07,1.65 v56.19,1.65 | 39.37,6.35 40.64,7.62 v41.91,7.62 | U$10.IN+ 21.72,6.35 39.37,6.35
BAT_LVL  (via drill 0.35)  (1 unrouted)
  Top 0.406: 28.89,18.95 28.95,18.95 29.46,18.44 29.46,17.78 28.83,17.14 v27.71,17.14
  Top 0.61: 4.45,24.49 v4.45,25.68
  Top 1.016: R34.1 4.45,24.49 5.2,24.49 R35.2
  Bottom 0.406: v27.71,17.14 27.71,16.92 26.67,15.88 25.4,15.88 24.05,17.22 24.05,18.56 23.01,19.61 21.67,19.61 15.88,25.4 15.88,38.81 15.31,39.37 13.97,39.37 6.99,32.39 6.99,28.22 v4.45,25.68
BOOT0  (via drill 0.35)
  Top 0.305: v31.27,26.47 31.69,26.05 STM32F103CB.44 31.69,24.19 33.83,22.05 33.84,22.05 35.14,20.75 35.14,18.02 36.09,17.07 36.09,14.14 R15.2 38.1,12.13 38.1,6.35 39.42,5.03 SW1.2
BOOT1
  Top 0.305: 36.88,3.39 SW1.1 36.88,7.57 34.92,9.52 34.92,12.33 R11.2 33.19,14.07 STM32F103CB.20
GND  (via drill 0.35)  (28 unrouted)
  Top 0.305: 40.69,29.79 C21.2 41.96,31.03 41.96,31.62 42.2,31.86 U1.11 | U1.18 45.88,30.32 46.35,29.85 50.17,29.85 C17.2 | v34.72,14.53 34.69,14.56 STM32F103CB.23 34.69,20.56 33.66,21.59 31.75,21.59 | STM32F103CB.47 30.19,23.79 31.02,22.95 31.75,22.95 31.75,21.59 | STM32F103CB.8 30.11,19.95 31.75,21.59 | 31.51,2.92 U$10.OUT- | PI_HEADER.28 31.77,39.78 29.23,39.78 PI_HEADER.31 26.72,39.8 24.18,39.8 PI_HEADER.36
  Top 0.406: Q8.2 47.12,25.3 45.54,25.3 Q6.2 | IC3.15 58.6,13.18 58.91,12.87 U5.4 58.91,10.84 59.35,10.4 | R10.1 61.99,23.47 | 7.23,21.9 6.92,21.59 | U2.7 9.2,26.35 8.89,26.04 | 8.89,26.04 8.55,26.37 U2.8 | U2.3 9.85,25.07 8.89,26.04 | 8.89,26.04 8.51,25.65 8.11,25.65 8.06,25.6 | R35.1 8.06,25.6 | 8.06,25.6 v7.29,26.36
  Top 0.508: PCA9533.4 12.69,32.39 v11.43,32.39
  Top 0.61: IC3.6 IC3.7 53.85,11.91 54,12.06 | IC3.6 IC3.5 | IC3.5 IC3.4 | IC3.14 54,12.06 | 54,12.06 IC3.15 | IC3.15 IC3.16 | IC3.17 IC3.16 | IC3.15 IC3.6 | IC3.5 IC3.16 | IC3.17 IC3.4 | IC2.7 IC2.14 IC2.15 | IC2.6 IC2.15 | IC2.5 IC2.16 | IC2.7 IC2.6 | IC2.6 IC2.5 | IC2.5 IC2.4 IC2.17 IC2.16 | IC2.16 IC2.15 | C6.- 59.05,19.68 57.78,18.41 57.15,18.41 55.88,17.14 55.88,16.51 55.09,15.72 IC3.17 | IC2.7 60.86,11.91 59.35,10.4 59.08,10.13 C12.- | LDIAR.P4 72.72,23.4 72.62,23.49 | C43.- 16.87,36.47 17.78,35.56 | 17.78,35.56 18.82,34.52 C34.- 19.52,33.63 20.48,32.67 22.86,32.67 23.13,32.94 23.13,33.14 C37.1 27.99,38 PI_HEADER.31 | Q7.2 65.72,27.87 v64.74,28.85 | 17.78,35.56 17.42,35.2 v13.97,35.2 | C38.2 35.43,29.01 C20.2 | C39.2 44.41,26.28 Q6.2 | C17.2 57.45,31.6 Q4.2 | R15.1 39.99,14.92 40.44,15.37 40.44,15.83 C3.- 40.95,15.72 41.91,15.72 | 41.91,15.72 IC3.4 | 41.91,15.72 v41.91,14.61
  Top 0.813: C9.2 59.24,19.71 C6.- | IRLML1.2 69.56,34.35 69.56,34.91 69.57,34.93 69.57,40.24 C10.- | C2.2 72.52,26.01 C14.- 72.62,23.49 72.62,21.69 C11.2 | C5.2 C8.2 15.87,3.04 U$10.IN-
  Top 1.016: C43.- 13.34,37.7 IRLML2502.2 | SUPPLY_IN1.1 4.45,8.99 C27.- | SUPPLY_IN.1 6.92,19.09 6.92,21.59 R35.1
  Top 1.27: C4.2 C5.2
  Top 1.524: C1.2 C18.2 C20.2
  Top 1.778: SUPPLY_IN.1 7.21,15.12 7.21,11.76 SUPPLY_IN1.1 8.26,6.45 C16.2
  Bottom 0.61: v41.91,14.61 34.8,14.61 v34.72,14.53
  Bottom 0.813: v7.29,26.36 8.43,26.36 C23.2 C24.2 8.76,30.35 10.79,32.39 v11.43,32.39 13.97,34.93 v13.97,35.2
  Bottom 2.54: SUPPLY_IN1.1 11.79,2.92 U$10.IN- U$10.OUT-
LIDAR_POS_INT  (via drill 0.35)
  Top 0.305: STM32F103CB.25 v38.25,17.95 v38.25,17.96
  Bottom 0.406: v38.25,17.96 39.55,17.96 41.06,19.47 45.02,19.47 50.32,24.76 70.8,24.76 71.43,25.4 LDIAR.P3
M_DIR_1  (via drill 0.35)
  Top 0.305: STM32F103CB.14 30.19,14.95 29.21,13.97 v27.94,13.97
  Top 0.406: 64.77,29.85 v64.77,31.11
  Top 0.813: R1.1 64.77,29.85 R9.1
  Bottom 0.406: v64.77,31.11 60.33,31.11 57.69,33.75 56.21,33.75 53.5,31.04 49.93,31.04 49.5,30.61 39.67,30.61 30.2,21.14 30.2,14.96 29.21,13.97 v27.94,13.97
M_DIR_2  (via drill 0.35)
  Top 0.305: STM32F103CB.15 30.69,15.03 v31.17,14.55
  Top 0.406: 51.44,28.32 51.21,28.55 v51.21,29.49
  Top 0.61: R13.1 51.44,28.32 R5.1
  Bottom 0.406: v51.21,29.49 40.13,29.49 32.33,21.69 32.33,17.73 31.17,16.56 v31.17,14.55
N$1  (via drill 0.35)
  Top 0.406: Q7.3 67.53,24.72 R4.1 67.53,20.74 v67.94,20.32
  Top 0.61: IC2.9 IC2.12 72.72,9.37 73.25,9.91 v73.25,18.49
  Bottom 0.406: v67.94,20.32 69.77,18.49 v73.25,18.49
N$2  (via drill 0.35)
  Top 0.813: IC3.18 v49.38,16.99
  Bottom 0.813: v49.38,16.99 49.38,7.14 50.8,5.72 52.07,5.72 52.41,5.37 ML2.P2
N$3  (via drill 0.35)
  Top 0.813: IC3.13 v50.7,10.64
  Bottom 0.813: ML2.P1 54.41,5.43 52.68,7.17 51.4,7.17 50.7,7.87 v50.7,10.64
N$4  (via drill 0.35)
  Top 0.813: IC2.18 v68.15,16.99
  Bottom 0.813: v68.15,16.99 68.15,8.69 70.83,6 MR2.P2
N$5
  Top 0.406: Q2.3 63.66,24.77 R10.2 65.41,21.8 65.41,18.26
  Top 0.61: IC2.19 67.31,18.26 65.41,18.26 IC2.2
N$6  (via drill 0.35)
  Top 0.406: Q8.3 49.21,24.24 R8.1 49.21,20.59 v49.15,20.52
  Top 0.61: IC3.9 IC3.12 v55.96,9.37
  Bottom 0.406: v55.96,9.37 52.7,12.62 52.7,19.68 51.87,20.52 v49.15,20.52
N$7
  Top 0.406: R14.2 52.64,22.8 52.98,23.14 Q5.3 | 52.55,21.67 R14.2 | R14.2 52.64,21.53 52.07,20.95 52.07,18.26
  Top 0.61: IC3.2 52.07,18.26 IC3.19
N$8  (via drill 0.35)
  Top 0.406: R7.1 59.48,25.4 60.33,25.4 60.96,24.76 60.96,19.51 60.98,19.48 61.04,19.53 62.23,19.53
  Top 0.61: IC2.1 62.23,19.53 v64.14,19.53 | IC2.11 v64.14,8.1 | R7.1 59.05,27.52 Q4.3
  Bottom 0.61: v64.14,19.53 v64.14,8.1
N$9  (via drill 0.35)
  Top 0.406: Q6.3 45.36,21.81 R12.1 45.4,19.54 45.41,19.53
  Top 0.61: IC3.1 45.41,19.53 v50.7,19.53 | IC3.11 v51.79,8.1
  Bottom 0.61: v50.7,19.53 51.79,18.44 v51.79,8.1
N$10
  Top 0.406: R1.2 63.72,28.14 63.72,27.87
  Top 0.61: 63.72,27.87 Q2.1
N$11
  Top 0.406: R2.2 59.91,31.04
  Top 0.61: Q4.1 59.91,31.04
N$12
  Top 0.406: R9.2 67.62,29.75 67.62,27.99
  Top 0.61: 67.62,27.99 Q7.1
N$13
  Top 0.61: Q5.1 53.93,28.22 R5.2
N$14
  Top 0.61: R6.2 46.21,26.52 Q6.1
N$15
  Top 0.61: Q8.1 48.38,28.25 R13.2
N$16  (via drill 0.35)
  Top 0.813: IC2.13 v69.39,10.64
  Bottom 0.813: MR2.P1 72.83,5.91 69.39,9.35 v69.39,10.64
N$17  (via drill 0.35)
  Top 0.813: IC2.8 v65.63,10.64
  Bottom 0.813: v65.63,10.64 65.63,7.85 63.84,6.06 MR1.P2
N$18  (via drill 0.35)
  Top 0.61: 66.9,16.99 v66.93,17.02
  Top 0.813: IC2.3 66.9,16.99
  Bottom 0.813: v66.93,17.02 66.93,7.24 65.84,6.16 MR1.P1
N$20  (via drill 0.35)  (1 unrouted)
  Top 0.406: R16.1 77.84,20.37 78.45,20.98 78.45,40.86 77.86,41.46 75.39,41.46 73.66,43.18 18.41,43.18 16.51,41.28 16.51,37.47
  Top 0.508: PCA9533.5 v12.7,24.15
N$21
  Top 0.813: R16.2 76.78,17.57 76.78,17.43 76.79,17.42 FRONTLIGHT.P1
N$22
  Top 0.508: PCA9533.3 13.98,33.65 13.34,34.29 R26.1
N$23
  Top 0.508: PCA9533.2 15.25,31.12 14.61,30.48 11.01,30.48 R27.1
N$24
  Top 0.508: PCA9533.1 16.51,31.11 14.61,29.21 R28.1
N$25  (via drill 0.35)
  Top 0.813: IC3.8 v47.02,10.64
  Bottom 0.813: v47.02,10.64 45.43,9.06 ML1.P2
N$26  (via drill 0.35)
  Top 0.813: IC3.3 v48.11,16.99
  Bottom 0.813: ML1.P1 47.43,6.49 48.11,7.16 v48.11,16.99
N$31
  Top 0.508: R26.2 4.01,34.29 RGB_LED.P4
N$33
  Top 0.61: RGB_LED.P3 7.66,32.14 R27.2
N$34
  Top 0.305: U1.20 46.99,31.86 47.1,31.86 48.85,31.86 C17.1
N$35
  Top 0.61: R28.2 7.12,30.14 RGB_LED.P2
N$36
  Top 0.305: C21.1 41.02,32.36 U1.10
N$37
  Top 0.508: IRLML2502.3 12.42,40.77 14.31,40.77 R22.2
N$38
  Top 0.813: R38.2 68.52,35.24 IRLML1.3
N$39
  Top 0.813: LIDAR.P2 76.8,38.43 D1.A 74.97,32.39 71.75,32.39 70.56,33.58 IRLML1.1
N$41  (5 unrouted)
N$42  (2 unrouted)
N$43  (2 unrouted)
N$46
  Top 0.305: STM32F103CB.6 23.43,20.95 23.42,20.95
  Top 0.406: C36.2 23.42,20.95 Q12.1
N$47
  Top 0.305: 24.29,31.91 C37.2 24.82,23.44 26.81,21.45 STM32F103CB.5
  Top 0.406: Q12.3 20.92,29.81 23.02,31.91 24.29,31.91
N$49
  Top 0.305: STM32F103CB.2 26.93,22.95 26.47,23.42 26.47,24.96 R30.1
N$55
  Top 1.016: IRLML2502.1 8.95,41.78 D3.A 8.89,41.73 8.1,40.93 FAN.P2
NRST  (via drill 0.35)
  Top 0.305: STM32F103CB.7 25.99,20.45 v25.6,20.07
  Bottom 0.305: PI_HEADER.26 34.27,39.73 34.27,37.67 32.79,36.2 28.57,36.2 27.3,34.93 27.3,21.77 v25.6,20.07
PWM_FAN  (via drill 0.35)
  Top 0.305: STM32F103CB.18 v32.19,14.56 v32.18,14.55
  Top 0.406: R22.1 v15.01,38.63
  Bottom 0.406: v32.18,14.55 31.9,14.27 31.9,14.25 31.47,13.82 30.24,13.82 29.53,13.11 20.42,13.11 16.84,16.69 16.84,21.74 15.01,23.57 v15.01,38.63
PWM_LIDAR  (via drill 0.35)
  Top 0.305: STM32F103CB.19 32.69,17.45 33.02,17.78 v33.66,17.78
  Top 0.406: R38.1 66.67,33.57 | 66.59,33.66 66.67,33.57 | 66.67,33.57 v66.67,31.11
  Bottom 0.406: v66.67,31.11 65.41,29.85 54.61,29.85 53.34,28.57 44.4,28.57 43.48,27.66 39.88,27.66 34.29,22.07 34.29,18.41 v33.66,17.78
PWM_M_EN_1  (via drill 0.35)
  Top 0.305: STM32F103CB.16 31.19,18.69 v31.19,19.15
  Top 0.406: R2.1 v56.52,33.02
  Bottom 0.406: v56.52,33.02 53.98,30.48 50.16,30.48 49.73,30.05 39.9,30.05 31.19,21.34 31.19,19.4 v31.19,19.15
PWM_M_EN_2  (via drill 0.35)
  Top 0.305: v33.35,18.92 32.56,18.92 31.69,18.05 STM32F103CB.17
  Top 0.406: R6.1 43.2,28.37 v43.18,28.4
  Bottom 0.406: v43.18,28.4 39.83,28.4 33.35,21.92 v33.35,18.92
SCL  (via drill 0.35)
  Top 0.305: STM32F103CB.42 32.69,26.06 v33.25,26.62 | U1.23 47.66,33.36 48.79,34.49 v48.79,35.76 | 19.05,16.81 19.05,16.34 19.55,15.84 21.46,15.84 R29.2
  Top 0.406: U2.5 10.5,26.33 11.1,25.73 11.1,23.55 12.37,22.28 14.2,22.28 19.05,17.42 19.05,16.81 | v22.33,18.26 R29.2
  Top 0.508: PCA9533.6 13.97,24.26 16.89,21.34 19.43,18.8 21.79,18.8 v22.33,18.26
  Bottom 0.406: v48.79,35.76 42.39,35.76 v33.25,26.62 33.25,24.98 29.21,20.94 29.21,16.51 27.3,14.61 24.77,14.61 22.33,17.04 v22.33,18.26 22.38,18.26
SDA  (via drill 0.35)
  Top 0.305: STM32F103CB.43 v32.19,26.97 | U1.24 47.2,33.86 47.83,34.49 v47.83,36.86
  Top 0.406: R20.2 v20.17,17.93 19.43,17.93 14.51,22.86 12.7,22.86 11.73,23.82 11.73,28.09 | U2.6 9.85,27.81 10.13,28.09 11.73,28.09 | PCA9533.7 15.24,27.56 14.71,28.09 11.73,28.09
  Bottom 0.406: v47.83,36.86 42.07,36.86 v32.19,26.97 32.19,24.71 28.63,21.15 28.63,16.89 26.98,15.24 25.15,15.24 23.5,16.89 23.5,18.33 22.78,19.05 21.29,19.05 v20.17,17.93
SWDIO
  Top 0.305: STM32F103CB.34 35.94,22.45 35.71,22.68 35.71,26.52 33.91,28.32 33.91,35.2 33.93,35.2 36.83,38.1 36.83,39.75 PI_HEADER.24
TEMPERATURE  (via drill 0.35)
  Top 0.305: R25.1 38.76,19.45 v38.6,19.45 STM32F103CB.28
  Top 0.406: U5.1 56.96,10.14 v56.97,10.13
  Bottom 0.406: v38.6,19.45 38.6,19.34 37.52,18.26 37.52,17.65 37.95,17.22 39.6,17.22 41.29,18.91 45.25,18.91 48.41,22.07 54.13,22.07 56.97,19.23 v56.97,10.13
U1_RX  (via drill 0.35)
  Top 0.305: v40.72,20.94 40.7,20.95 STM32F103CB.31
  Bottom 0.406: LDIAR.P1 73.85,29.4 70.48,26.04 50.01,26.04 44.91,20.94 v40.72,20.94
U1_TX  (via drill 0.35)
  Top 0.305: v39.55,20.06 39.16,20.45 STM32F103CB.30
  Bottom 0.406: LDIAR.P2 72.64,27.4 70.64,25.4 50.16,25.4 44.83,20.06 v39.55,20.06
USART2_RX  (via drill 0.35)
  Top 0.305: STM32F103CB.13 29.69,15.21 29.49,15.01 28.42,15.01 v26.39,17.02
  Bottom 0.305: PI_HEADER.34 25.45,40.69 24.13,39.37 24.13,38.1 26.04,36.2 26.04,23.09 24.11,21.16 24.11,19.33 v26.39,17.02
USART2_TX  (via drill 0.35)
  Top 0.305: STM32F103CB.12 v26.6,17.95 v26.59,17.96
  Bottom 0.305: PI_HEADER.32 26.7,39.78 26.7,22.87 24.77,20.94 24.77,19.68 26.49,17.96 v26.59,17.96
USB_DM  (via drill 0.35)
  Top 0.305: STM32F103CB.32 39.05,21.45 v39.9,22.3
USB_DP  (via drill 0.35)
  Top 0.305: STM32F103CB.33 38.26,21.95 v38.66,22.35
V+  (via drill 0.35)
  Top 0.406: 9.82,3.34 9.53,3.04 | U2.1 8.55,23.43 v8.15,23.04
  Top 0.813: 4.65,20.75 SUPPLY_IN.2
  Top 1.016: R34.2 1.79,24.04 SUPPLY_IN.2
  Top 1.778: SUPPLY_IN.2 2.54,18.21 2.54,15.67 SUPPLY_IN1.2 1.91,9.95 1.91,3.81 2.69,3.02 C27.+ 4.47,3.04 C16.1 9.53,3.04 R17.2
  Bottom 0.406: SUPPLY_IN.2 7.37,23.04 v8.15,23.04
(copper drawn outside any net)
  shapes: Top area x8, Top circle x1